# EAGLE design Gecko-Node (EAGLE 7.7.0)
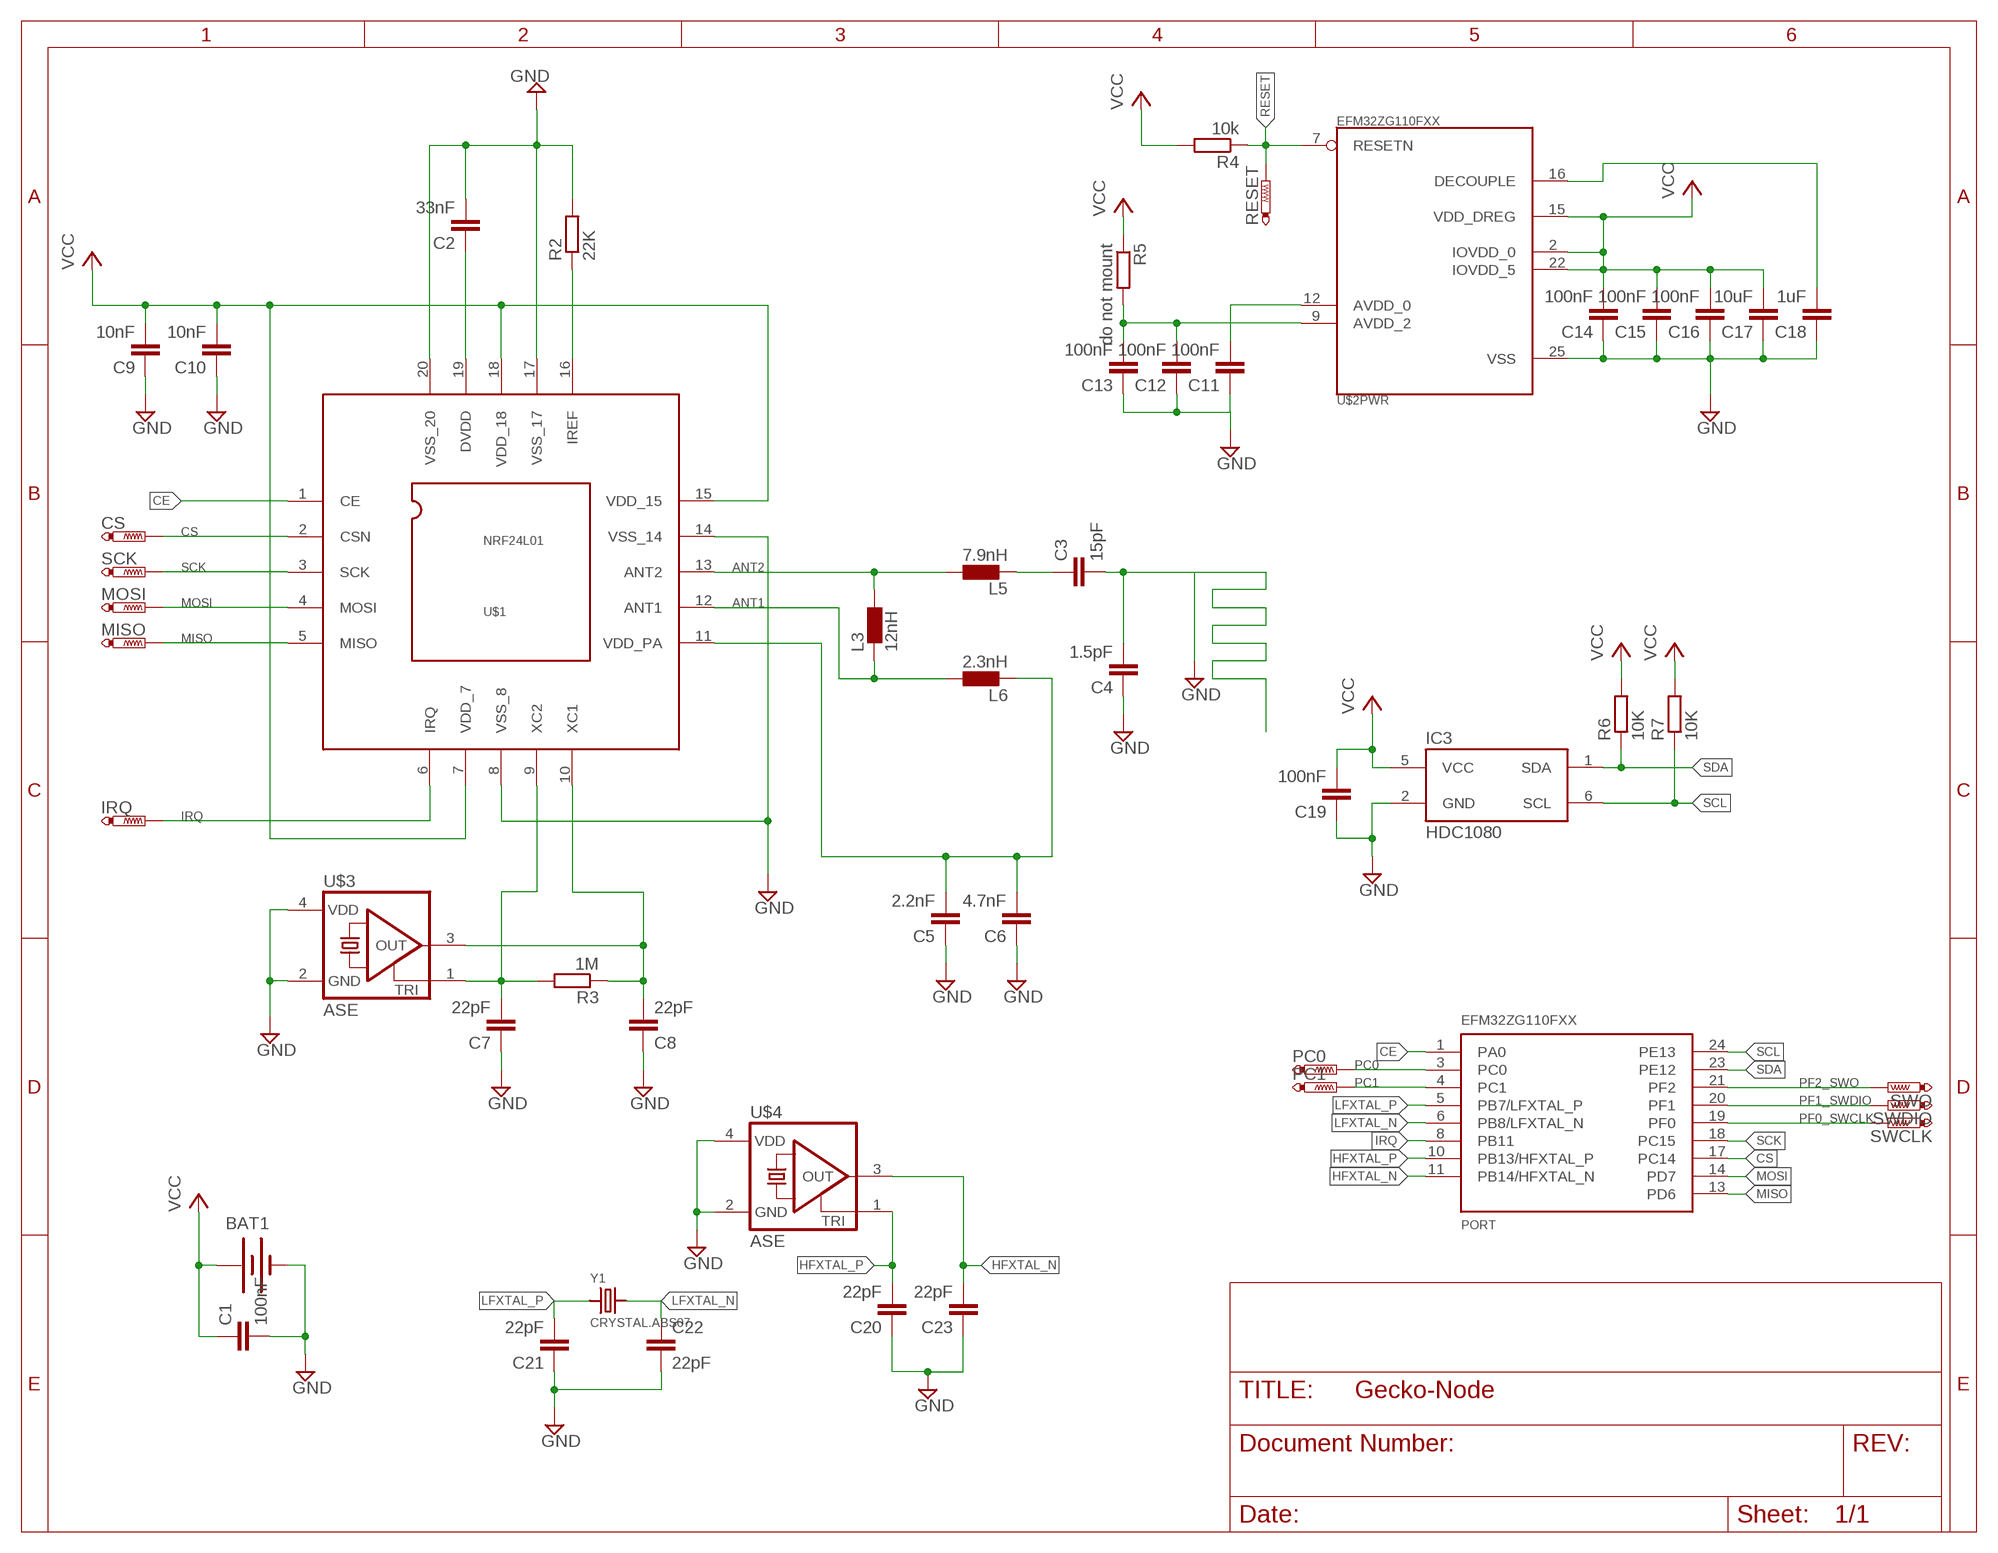
[diagram p0: schematic, sheet 1]

## Parts
BAT1  LINX-BAT-HLD-00120SMD  [BATTCON_20MM]
C1  100nF  C-EUC0603  [C0603]
C2  33nF  C-EUC0603  [C0603]
C3  15pF  C-EUC0603  [C0603]
C4  1.5pF  C-EUC0603  [C0603]
C5  2.2nF  C-EUC0603  [C0603]
C6  4.7nF  C-EUC0603  [C0603]
C7  22pF  C-EUC0603  [C0603]
C8  22pF  C-EUC0603  [C0603]
C9  10nF  C-EUC0603  [C0603]
C10  10nF  C-EUC0603  [C0603]
C11  100nF  C-EUC0603  [C0603]
C12  100nF  C-EUC0603  [C0603]
C13  100nF  C-EUC0603  [C0603]
C14  100nF  C-EUC0603  [C0603]
C15  100nF  C-EUC0603  [C0603]
C16  100nF  C-EUC0603  [C0603]
C17  10uF  C-EUC0603  [C0603]
C18  1uF  C-EUC0603  [C0603]
C19  100nF  C-EUC0603  [C0603]
C20  22pF  C-EUC0603  [C0603]
C21  22pF  C-EUC0603  [C0603]
C22  22pF  C-EUC0603  [C0603]
C23  22pF  C-EUC0603  [C0603]
CS  PTR1TP08R  [TP08R]
IC3  HDC1080  [WSON6]
IRQ  PTR1TP08R  [TP08R]
L3  12nH  L  [R0603]
L5  7.9nH  L  [R0603]
L6  2.3nH  L  [R0603]
MISO  PTR1TP08R  [TP08R]
MOSI  PTR1TP08R  [TP08R]
PC0  PTR1TP08R  [TP08R]
PC1  PTR1TP08R  [TP08R]
R2  22K  R-EU_R0603  [R0603]
R3  1M  R-EU_R0603  [R0603]
R4  10k  R-EU_R0603  [R0603]
R5  do not mount  R-EU_R0603  [R0603]
R6  10K  R-EU_R0603  [R0603]
R7  10K  R-EU_R0603  [R0603]
RESET  PTR1TP08R  [TP08R]
SCK  PTR1TP08R  [TP08R]
SWCLK  PTR1TP08R  [TP08R]
SWDIO  PTR1TP08R  [TP08R]
SWO  PTR1TP08R  [TP08R]
U$1  NRF24L01  [QFN20]
U$2  EFM32ZG110FXX  [QFN24]
U$3  ASE  [ASE]
U$4  ASE  [ASE]
Y1  CRYSTAL.ABS07  [ABS07]

## Nets
ANT1: L3.2 L6.1 U$1.12(ANT1)
ANT2: L3.1 L5.1 U$1.13(ANT2)
CE: U$1.1(CE) U$2.1(A:PA0)
CS: CS.TP U$1.2(CSN) U$2.17(A:PC14)
DECOUPLE: C18.2 U$2.16(PWR:DECOUPLE)
GND: BAT1.2(-) C1.2 C2.2 C3.2 C4.1 C4.2 C5.1 C6.1 C7.1 C8.1 C9.1 C10.1 C11.1 C12.1 C13.1 C14.1 C15.1 C16.1 C17.1 C18.1 C19.1 C20.1 C21.1 C22.2 C23.1 IC3.2(GND) R2.2 U$1.8(VSS_8) U$1.14(VSS_14) U$1.17(VSS_17) U$1.20(VSS_20) U$2.25(PWR:VSS) U$3.2(GND) U$3.4(VDD) U$4.2(GND) U$4.4(VDD)
HFXTAL_N: C23.2 U$2.11(A:PB14/HFXTAL_N) U$4.3(OUT)
HFXTAL_P: C20.2 U$2.10(A:PB13/HFXTAL_P) U$4.1(TRI)
IRQ: IRQ.TP U$1.6(IRQ) U$2.8(A:PB11)
LFXTAL_N: C22.1 U$2.6(A:PB8/LFXTAL_N) Y1.2
LFXTAL_P: C21.2 U$2.5(A:PB7/LFXTAL_P) Y1.1
MISO: MISO.TP U$1.5(MISO) U$2.13(A:PD6)
MOSI: MOSI.TP U$1.4(MOSI) U$2.14(A:PD7)
N$2: C7.2 R3.2 U$1.9(XC2) U$3.1(TRI)
N$3: R2.1 U$1.16(IREF)
N$4: C2.1 U$1.19(DVDD)
N$5: C8.2 R3.1 U$1.10(XC1) U$3.3(OUT)
N$8: C3.1 L5.2
N$10: C11.2 U$2.12(PWR:AVDD_0)
N$11: C5.2 C6.2 L6.2 U$1.11(VDD_PA)
N$12: C12.2 C13.2 R5.2 U$2.9(PWR:AVDD_2)
PC0: PC0.TP U$2.3(A:PC0)
PC1: PC1.TP U$2.4(A:PC1)
PF0_SWCLK: SWCLK.TP U$2.19(A:PF0)
PF1_SWDIO: SWDIO.TP U$2.20(A:PF1)
PF2_SWO: SWO.TP U$2.21(A:PF2)
RESET: R4.1 RESET.TP U$2.7(PWR:RESETN)
SCK: SCK.TP U$1.3(SCK) U$2.18(A:PC15)
SCL: IC3.6(SCL) R7.1 U$2.24(A:PE13)
SDA: IC3.1(SDA) R6.1 U$2.23(A:PE12)
VCC: BAT1.1(+) BAT1.3(+) C1.1 C9.2 C10.2 C14.2 C15.2 C16.2 C17.2 C19.2 IC3.5(VCC) R4.2 R5.1 R6.2 R7.2 U$1.7(VDD_7) U$1.15(VDD_15) U$1.18(VDD_18) U$2.2(PWR:IOVDD_0) U$2.15(PWR:VDD_DREG) U$2.22(PWR:IOVDD_5)

## Library data of the parts
BAT1 = battery:LINX-BAT-HLD-001: Battery Holders Linxtechnologies CR2032 battery holder: http://www.linxtechnologies.com/resources/diagrams/bat-hld-001.pdf
C1-C23 = rcl:C-EU: CAPACITOR, European symbol
CS IRQ MISO MOSI PC0 PC1 RESET SCK SWCLK SWDIO SWO = testpad:PTR1: TEST PIN
IC3 = HDC1080:HDC1080
L3 L5 L6 = L0603:L: INDUCTOR, European symbol
R2-R7 = rcl:R-EU_: RESISTOR, European symbol
U$1 = nrf24l01:NRF24L01: nRF24L01 Single chip 2.4GHz transceiver from Nordic Semiconductors.
U$2 = ZeroGecko:EFM32ZG110FXX: EFM32ZG110FXX Zero Microcontroller in 5mm x 5mm QFN24 package
U$3 U$4 = crystal:ASE: 3.3Vdc CMOS SMD CRYSTAL CLOCK OSCILLATOR SOurce: www.abracon.com; OC_FARNELL: unknown; OC_NEWARK: unknown
Y1 = abracon:CRYSTAL

## Board
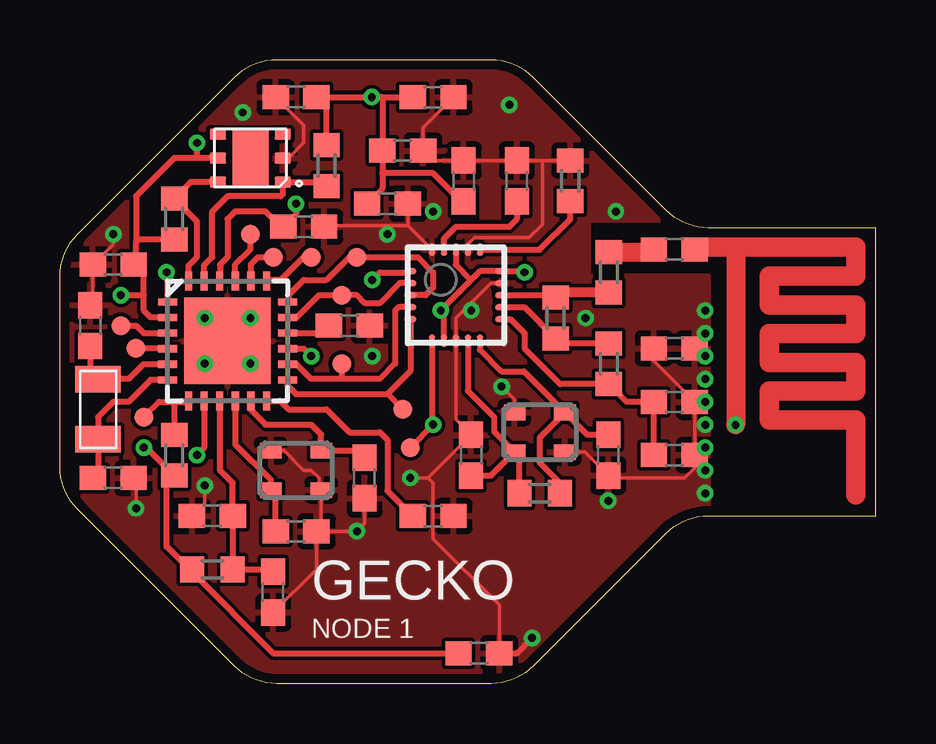
[diagram p1: board, top side]
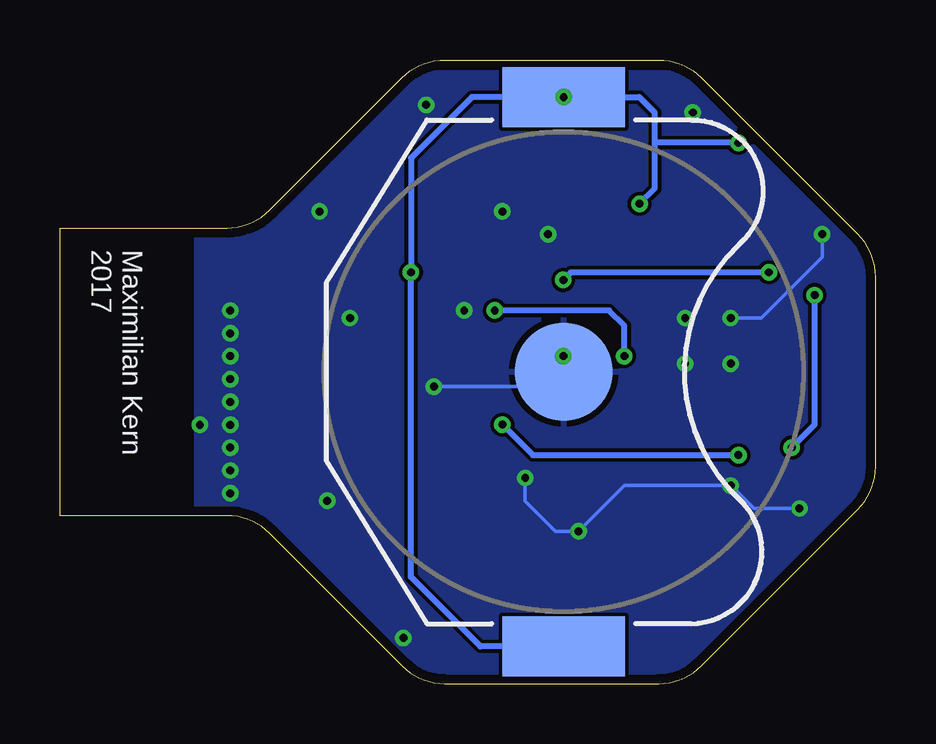
[diagram p2: board, bottom side, seen from below]

Size 34 x 26 mm. Coordinates in mm from the lower left corner, seen from the top.
Outline: 34,19 27.04,19 arc-45 25.27,19.73 19.73,25.27 arc45 17.96,26 9.04,26 arc45 7.27,25.27 0.73,18.73 arc45 0,16.96 0,9.04 arc45 0.73,7.27 7.27,0.73 arc45 9.04,0 17.96,0 arc45 19.73,0.73 25.27,6.27 arc-45 27.04,7 34,7 34,19
Copper layers (1*16): Top 0.0356mm / dielectric 1.5011mm / Bottom 0.0356mm
Design rules "oshpark-2layer *": minimum track width 6mil, minimum drill 13mil, track to track 6mil, track to pad 6mil, pad to pad 6mil, via to via 6mil, smd to smd 6mil, copper to edge 15mil, drill to drill 6mil, minimum pad ring 7mil, minimum via ring 7mil, stop-mask expansion 2.5mil, vias tented up to drill 50mil, thermal gap 10mil

### Footprints (pad centres in the part's own frame; a part is rotated, then mirrored left to right if it is on the bottom)
BATTCON_20MM = smd 2.5 x 5.1: 1 -11.45,0; 3 11.45,0 | smd 4.064 x 4.064: 2 0,0
C0603 = smd 1.1 x 1: 1 -0.85,0; 2 0.85,0
TP08R = smd 0.8 x 0.8: TP 0,0
WSON6 = smd 0.7 x 0.45: 1 -1.35,1; 2 -1.35,0; 3 -1.35,-1; 4 1.35,-1; 5 1.35,0; 6 1.35,1 | smd 1.5 x 2.4: P$1 0,0
R0603 = smd 1 x 1.1: 1 -0.85,0; 2 0.85,0
QFN20 = smd 0.5 x 0.25: 1 -1.9,1; 2 -1.9,0.5; 3 -1.9,0; 4 -1.9,-0.5; 5 -1.9,-1; 11 1.9,-1; 12 1.9,-0.5; 13 1.9,0; 14 1.9,0.5; 15 1.9,1 | smd 0.25 x 0.5: 6 -1,-1.9; 7 -0.5,-1.9; 8 0,-1.9; 9 0.5,-1.9; 10 1,-1.9; 16 1,1.9; 17 0.5,1.9; 18 0,1.9; 19 -0.5,1.9; 20 -1,1.9
QFN24 = smd 0.8 x 0.3: 1 -2.5,1.625; 2 -2.5,0.975; 3 -2.5,0.325; 4 -2.5,-0.325; 5 -2.5,-0.975; 6 -2.5,-1.625; 13 2.5,-1.625; 14 2.5,-0.975; 15 2.5,-0.325; 16 2.5,0.325; 17 2.5,0.975; 18 2.5,1.625 | smd 0.3 x 0.8: 7 -1.625,-2.5; 8 -0.975,-2.5; 9 -0.325,-2.5; 10 0.325,-2.5; 11 0.975,-2.5; 12 1.625,-2.5; 19 1.625,2.5; 20 0.975,2.5; 21 0.325,2.5; 22 -0.325,2.5; 23 -0.975,2.5; 24 -1.625,2.5 | smd 3.6 x 3.6: 25 0,0
ASE = smd 0.9 x 0.65: 1 -1.05,-0.825; 2 1.05,-0.825; 3 1.05,0.825; 4 -1.05,0.825
ABS07 = smd 1.1 x 1.9: 1 -1.25,0; 2 1.25,0

### Placement (x,y rotation side)
BAT1  13,13 270 bottom
C1  17.46,1.27 0 top
C2  19.05,20.95 90 top
C3  25.61,18.1 0 top
C4  25.61,13.97 0 top
C5  25.61,9.53 180 top
C6  25.61,11.75 180 top
C7  17.14,9.53 270 top
C8  22.86,9.53 90 top
C9  16.83,20.95 270 top
C10  13.65,20 180 top
C11  15.56,6.99 180 top
C12  8.89,3.81 90 top
C13  6.35,6.99 0 top
C14  10.16,19.05 180 top
C15  14.29,22.23 180 top
C16  2.22,17.46 0 top
C17  15.56,24.45 180 top
C18  12.06,14.92 180 top
C19  9.84,24.45 0 top
C20  9.84,6.35 180 top
C21  1.27,14.92 270 top
C22  2.22,8.57 0 top
C23  12.7,8.57 90 top
CS  11.75,16.19 0 top
IC3  7.94,21.91 180 top
IRQ  14.61,9.84 0 top
L3  20.66,15.24 270 top
L5  22.88,17.14 90 top
L6  22.88,13.34 270 top
MISO  14.29,11.43 0 top
MOSI  11.75,13.34 0 top
PC0  2.54,14.92 0 top
PC1  3.17,13.97 0 top
R2  21.27,20.95 90 top
R3  20,7.94 180 top
R4  4.76,9.53 270 top
R5  6.35,4.76 0 top
R6  11.11,21.59 90 top
R7  4.76,19.37 270 top
RESET  3.49,11.11 0 top
SCK  12.38,17.78 0 top
SWCLK  10.48,17.78 0 top
SWDIO  8.89,17.78 0 top
SWO  7.94,18.73 0 top
U$1  16.51,16.19 0 top
U$2  6.99,14.29 0 top
U$3  20,10.48 0 top
U$4  9.84,8.89 0 top
Y1  1.59,11.43 270 top

### Tracks (layer width: path | path; a pad name or v marks a point on that pad's centre or on a via)
ANT1
  Top 0.254: L6.1 20.55,14.19 L3.2 19.36,15.69 U$1.12
ANT2
  Top 0.254: 20.24,16.19 L3.1 | 20.55,16.3 L3.1 | U$1.13 20.56,16.19 L3.1
  Top 0.406: L5.1 20.55,16.3
CE  (via drill 0.33)
  Top 0.254: U$2.1 4.49,17.11 v4.45,17.14 | v13.02,16.83 13.34,17.14 14.56,17.14 U$1.1
  Bottom 0.254: v4.45,17.14 12.7,17.14 v13.02,16.83
CS
  Top 0.254: U$2.17 9.87,15.26 10.79,16.19 CS.TP 12.38,16.19 12.7,15.88 13.34,15.88 14.15,16.69 U$1.2
DECOUPLE
  Top 0.254: U$2.16 11.21,14.61 C18.2
GND  (via drill 0.33)
  Top 0.152: U$1.14 17.96,16.69 16.51,15.24 U$1.8 16.51,11.01 C7.1 15.34,8.57 | R2.2 20.11,21.8 | 20.11,21.8 C2.2 C9.1 15.56,21.8 C15.1 15.14,23.18 C17.1 | 20.11,21.8 20.11,19.14 19.56,18.59 17.27,18.59 17.01,18.33 U$1.17 | IC3.2 9.53,21.91 10.16,22.54 10.16,23.28 C19.1 | C10.1 14.5,19.1 | 14.5,19.1 U$1.20 | 14.5,19.1 11.06,19.1 C14.1 | C4.1 24.76,13.45 C6.1 C5.1 26.46,9 26.04,8.57 22.96,8.57 C8.1 21.88,9.65 U$3.2 | U$3.4 18.95,11.85 v18.41,12.38 | C1.2 18.31,3.28 15.56,6.03 15.56,8.36 15.34,8.57 | v6.03,8.26 6.03,7.52 C13.1 | v2.22,18.73 2.22,18.31 C16.1 1.37,15.99 | v3.17,7.3 3.17,8.47 C22.2 | v6.03,15.24 v7.94,15.24 v7.94,13.34 U$2.25 | U$4.4 9.34,9.71 10.16,8.89 10.48,8.89 10.79,8.57 10.79,8.16 U$4.2 10.89,6.55 C20.1 | C20.1 10.69,4.76 C12.1 | C20.1 v12.38,6.35 12.7,6.67 C23.1 | v14.61,8.57 15.34,8.57
  Top 0.254: 1.37,15.99 C21.1 | v6.03,13.34 U$2.25 | C1.2 19.05,1.27 v19.68,1.91
  Top 0.8: 28.17,18.19 v28.17,10.79
  Top 0.813: C3.2 26.46,18.19 28.17,18.19 33.17,18.19 33.17,16.99 29.57,16.99 29.57,15.79 33.17,15.79 33.17,14.59 29.57,14.59 29.57,13.39 33.17,13.39 33.17,12.19 29.57,12.19 29.57,10.99 33.17,10.99 33.17,7.86
  Bottom 0.152: v18.41,12.38 13.62,12.38 BAT1.2 13,14.59 | v6.03,15.24 4.76,15.24 2.22,17.78 v2.22,18.73 | v3.17,7.3 5.08,7.3 v6.03,8.26 10.48,8.26 v12.38,6.35 13.34,6.35 14.61,7.62 v14.61,8.57
  other vias: 13.02,13.65 22.86,7.62 13.65,18.73 15.56,19.68 23.18,19.68 18.73,24.13 7.62,23.81 21.91,15.24 17.14,15.56 26.9,15.55 26.9,14.6 26.9,13.65 26.9,12.7 26.9,11.74 26.9,10.79 26.9,9.84 26.9,8.88 26.9,7.93
  pour Bottom: 8,26 0,18 0,8 8,0 19,0 26,7 28.29,7 28.29,19 26,19 19,26
  pour Top: 26,7 19,0 8,0 0,8 0,18 8,26 19,26 25,20 25,19.32 22,19.32 22,17 27.02,17 27.02,7
HFXTAL_N
  Top 0.254: U$2.11 7.96,11.41 8.57,10.79 10.48,10.79 10.89,10.38 U$4.3 12.41,9.71 C23.2
HFXTAL_P
  Top 0.254: U$2.10 7.31,9.97 8.79,8.49 U$4.1 8.99,7.87 C20.2
IRQ  (via drill 0.33)
  Top 0.254: U$2.8 6.01,9.82 v5.71,9.53 | U$1.6 15.51,10.84 v15.56,10.79 IRQ.TP
  Bottom 0.254: v15.56,10.79 14.29,9.53 v5.71,9.53
LFXTAL_N
  Top 0.254: U$2.6 3.77,12.66 2.86,11.75 2.22,11.75 1.59,11.11 Y1.2 1.59,8.79 C22.1
LFXTAL_P
  Top 0.254: C21.2 1.27,13 Y1.1 1.61,12.7 2.86,12.7 3.47,13.31 U$2.5
MISO
  Top 0.254: U$1.5 14.61,13.02 13.65,12.06 | 13.65,12.06 9.84,12.06 9.48,12.42 U$2.13 | MISO.TP 13.65,12.06
MOSI
  Top 0.254: U$1.4 14.11,15.69 13.97,15.56 13.97,13.34 13.34,12.7 11.75,12.7 | U$2.14 9.87,13.31 10.48,12.7 11.75,12.7 | MOSI.TP 11.75,12.7
N$2
  Top 0.254: C7.2 17.98,8.68 U$3.1 | U$1.9 17.01,12.2 18.1,11.11 18.1,10.51 U$3.1 | R3.2 19.15,9.45 U$3.1
N$3
  Top 0.254: U$1.16 20,18.09 21.27,19.37 R2.1
N$4
  Top 0.254: C2.1 19.05,19.37 18.73,19.05 16.51,19.05 16.01,18.55 U$1.19
N$5
  Top 0.254: C8.2 21.98,10.38 U$3.3 | U$1.10 17.51,13.92 18.41,13.02 19.34,13.02 U$3.3 | R3.1 20.85,8.36 20,9.21 20,10.25 U$3.3
N$8
  Top 0.254: 24.66,18 C3.1
  Top 0.8: L5.2 24.66,18
N$10
  Top 0.254: U$2.12 9.17,11.79 9.53,11.43 11.11,11.43 12.06,10.48 13.34,10.48 13.65,10.16 13.65,8.04 C11.2
N$11
  Top 0.254: C5.2 C6.2 23.62,11.75 L6.2 20.85,12.48 19.37,13.97 19.37,14.61 18.78,15.19 U$1.11
N$12
  Top 0.254: C12.2 8.79,4.76 R5.2 C13.2 7.2,8.36 6.66,8.9 U$2.9
PC0
  Top 0.254: PC0.TP 3.17,14.92 3.49,14.61 4.48,14.61 U$2.3
PC1
  Top 0.254: U$2.4 3.18,13.96 PC1.TP
PF0_SWCLK
  Top 0.254: SWCLK.TP 10.16,17.78 9.21,16.83 8.65,16.83 U$2.19
PF1_SWDIO
  Top 0.254: U$2.20 7.96,17.48 8.26,17.78 SWDIO.TP
PF2_SWO
  Top 0.254: U$2.21 7.31,17.47 7.94,18.1 SWO.TP
RESET
  Top 0.254: 4.76,11.75 5.32,11.75 U$2.7 | 4.76,11.75 R4.1 | RESET.TP 4.13,11.75 4.76,11.75
SCK
  Top 0.254: U$1.3 15.24,16.19 15.56,16.51 15.56,17.14 14.92,17.78 SCK.TP 12.06,17.78 11.11,16.83 10.16,16.83 9.53,16.19 9.53,15.95 U$2.18
SCL
  Top 0.254: U$2.24 5.36,17.43 5.71,17.78 5.71,19.27 R7.1 5.45,20.91 IC3.6
SDA
  Top 0.254: U$2.23 6.01,17.44 6.35,17.78 6.35,19.68 6.99,20.32 9.21,20.32 9.29,20.4 IC3.1 10.95,20.91 R6.1
VCC  (via drill 0.33)
  Top 0.254: 17.14,16.83 17.51,17.19 U$1.15 19.32,17.19 v19.37,17.14 | 17.14,16.83 16.01,15.69 16.01,15.56 | U$1.7 16.01,15.56 | U$1.18 16.51,17.46 17.14,16.83 | R6.2 11.11,24.03 C19.2 BAT1.1 13.44,24.45 | 13.44,24.45 C17.2 | 13.44,24.45 C15.2 13.44,21.27 | IC3.5 5.71,21.91 | 5.71,21.91 4.76,21.91 3.17,20.32 3.17,18.41 | R7.2 3.28,18.52 3.17,18.41 | U$2.2 3.79,15.26 3.49,15.56 3.49,16.19 | 13.44,21.27 13.44,20.64 C10.2 | C9.2 16.73,20.11 15.56,21.27 13.44,21.27 | U$2.22 6.67,17.46 6.99,17.78 6.99,19.37 7.3,19.68 8.57,19.68 9.21,19.05 C14.2 9.84,19.58 v9.84,20 | 3.49,16.19 3.49,17.04 C16.2 3.17,17.25 3.17,18.41 | C1.1 8.89,1.27 5.5,4.66 R5.1 5.4,4.76 4.45,5.71 4.45,8.36 R4.2 3.6,9.84 v3.49,9.84 | U$2.15 10.17,13.96 v10.48,13.65 | v15.88,15.56 16.01,15.56 | 5.71,21.91 v5.71,22.54 | v2.54,16.19 3.49,16.19
  Bottom 0.254: v10.48,13.65 10.48,14.92 11.11,15.56 v15.88,15.56 | v5.71,22.54 9.21,22.54 | 9.21,22.54 9.21,23.81 9.85,24.45 BAT1.1 16.82,24.45 19.37,21.91 v19.37,17.14 19.37,4.45 16.47,1.55 BAT1.3 | v3.49,9.84 2.54,10.79 v2.54,16.19 | v9.84,20 9.21,20.64 9.21,22.54
  other vias: 13,24.45

### Text on the board
tNames: GECKO | NODE 1
bNames: Maximilian Kern / 2017